# Altium schematic sheet 03_USB.SchDoc
size A3; SheetNumber: 4; SheetTotal: 5
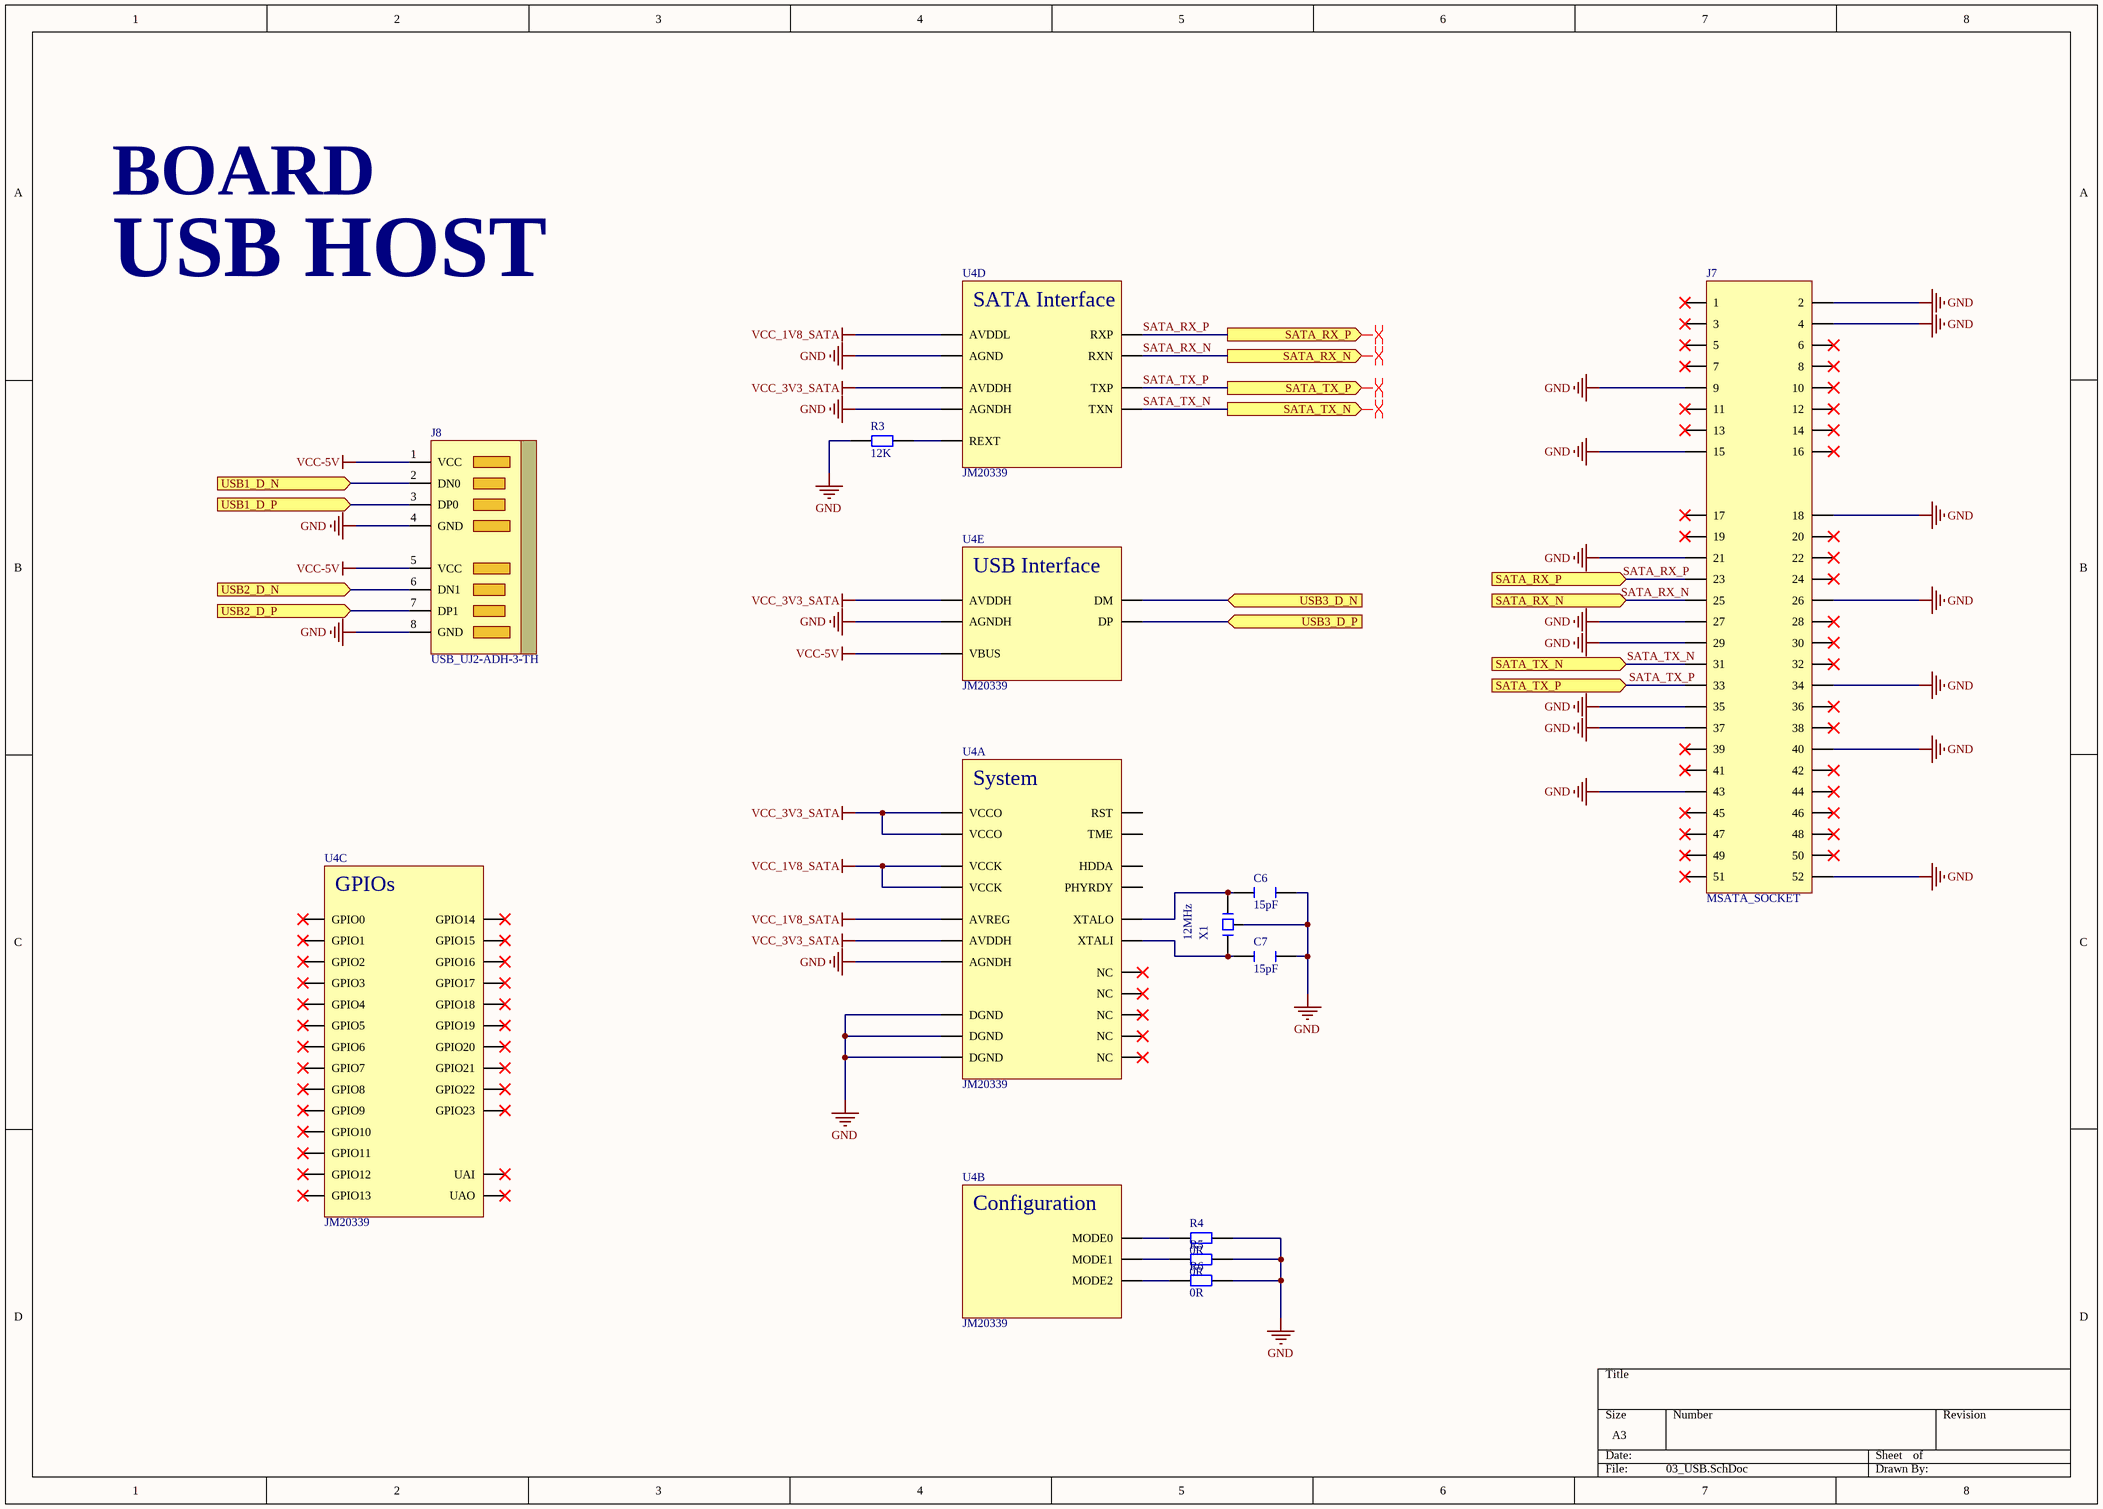
[diagram p0: 03_USB.SchDoc]

## Parts
C6  15pF  [C0402]
C7  15pF  [C0402]
J7  MSATA_SOCKET  [MSATA_SOCKET]
J8  USB_UJ2-ADH-3-TH  [UJ2-ADH-3-TH]
R3  12K  [R0603]
R4  0R  [R0603]
R5  0R  [R0603]
R6  0R  [R0603]
U4  JM20339  [JM20339]  (parts A,B,C,D,E of 5)
X1  12MHz  [SMD3225]

## Ports
SATA_RX_N (in), SATA_RX_N (out), SATA_RX_P (in), SATA_RX_P (out), SATA_TX_N (in), SATA_TX_N (out), SATA_TX_P (in), SATA_TX_P (out), USB1_D_N (in), USB1_D_P (in), USB2_D_N (in), USB2_D_P (in), USB3_D_N (in), USB3_D_P (in)

## Nets
GND: C6.2 C7.2 J7.2 J7.4 J7.9 J7.15 J7.18 J7.21 J7.26 J7.27 J7.29 J7.34 J7.35 J7.37 J7.40 J7.43 J7.52 J8.4(GND) J8.8(GND) R3.1 R4.2 R5.2 R6.2 U4.7(DGND) U4.16(AGNDH) U4.22(AGNDH) U4.25(AGNDH) U4.30(AGND) U4.41(DGND) U4.57(DGND) X1.3(G)
VCC-5V: J8.1(VCC) J8.5(VCC) U4.13(VBUS)
VCC_1V8_SATA: U4.14(AVREG) U4.29(AVDDL) U4.42(VCCK) U4.58(VCCK)
VCC_3V3_SATA: U4.8(VCCO) U4.15(AVDDH) U4.21(AVDDH) U4.24(AVDDH) U4.56(VCCO)
SATA_RX_N: J7.25 U4.28(RXN) ; port SATA_RX_N
SATA_RX_P: J7.23 U4.27(RXP) ; port SATA_RX_P
SATA_TX_N: J7.31 U4.31(TXN) ; port SATA_TX_N
SATA_TX_P: J7.33 U4.32(TXP) ; port SATA_TX_P
USB1_D_N: J8.2(DN0) ; port USB1_D_N
USB1_D_P: J8.3(DP0) ; port USB1_D_P
USB2_D_N: J8.6(DN1) ; port USB2_D_N
USB2_D_P: J8.7(DP1) ; port USB2_D_P
USB3_D_N: U4.19(DM) ; port USB3_D_N
USB3_D_P: U4.20(DP) ; port USB3_D_P
NetC6_1: C6.1 U4.18(XTALO) X1.2(OUT)
NetC7_1: C7.1 U4.17(XTALI) X1.1(IN)
NetR3_2: R3.2 U4.26(REXT)
NetR4_1: R4.1 U4.59(MODE0)
NetR5_1: R5.1 U4.55(MODE1)
NetR6_1: R6.1 U4.4(MODE2)

Not connected (* = marked no-connect by the designer): J7 1* 3* 5* 6* 7* 8* 10* 11* 12* 13* 14* 16* 17* 19* 20* 22* 24* 28* 30* 32* 36* 38* 39* 41* 42* 44* 45* 46* 47* 48* 49* 50* 51*; U4 1(GPIO21)* 2(GPIO22)* 3(GPIO23)* 5(NC)* 6(NC)* 9(NC)* 10(NC)* 11(GPIO7)* 12(RST) 23(NC)* 33(GPIO3)* 34(GPIO2)* 35(GPIO1)* 36(GPIO0)* 37(TME) 38(PHYRDY) 39(HDDA) 40(GPIO4)* 43(GPIO5)* 44(GPIO6)* 45(GPIO9)* 46(GPIO10)* 47(GPIO11)* 48(GPIO12)* 49(GPIO13)* 50(GPIO14)* 51(GPIO15)* 52(GPIO8)* 53(UAI)* 54(UAO)* 60(GPIO16)* 61(GPIO17)* 62(GPIO18)* 63(GPIO19)* 64(GPIO20)*

## Layout directives
differential pair; net class SATA; differential pair class SATA_TXRX; differential pair class SATA_RX: SATA_RX_N, SATA_RX_P
differential pair; net class SATA; differential pair class SATA_TXRX; differential pair class SATA_TX: SATA_TX_N, SATA_TX_P

## Notes on the sheet
- BOARD
- USB HOST
- Labels drawn without touching a wire or pin: SATA_RX_N, SATA_RX_P, SATA_TX_N, SATA_TX_P
- (in symbol JM20339, part A) System
- (in symbol JM20339, part B) Configuration
- (in symbol JM20339, part C) GPIOs
- (in symbol JM20339, part D) SATA Interface
- (in symbol JM20339, part E) USB Interface

## Library data of the parts
C6 C7 = C_15PF
R3 = R_12K
R4-R6 = R_0R
X1 = X_12MHZ